# EAGLE design CAA-NMC-2 (EAGLE 9.2.2)
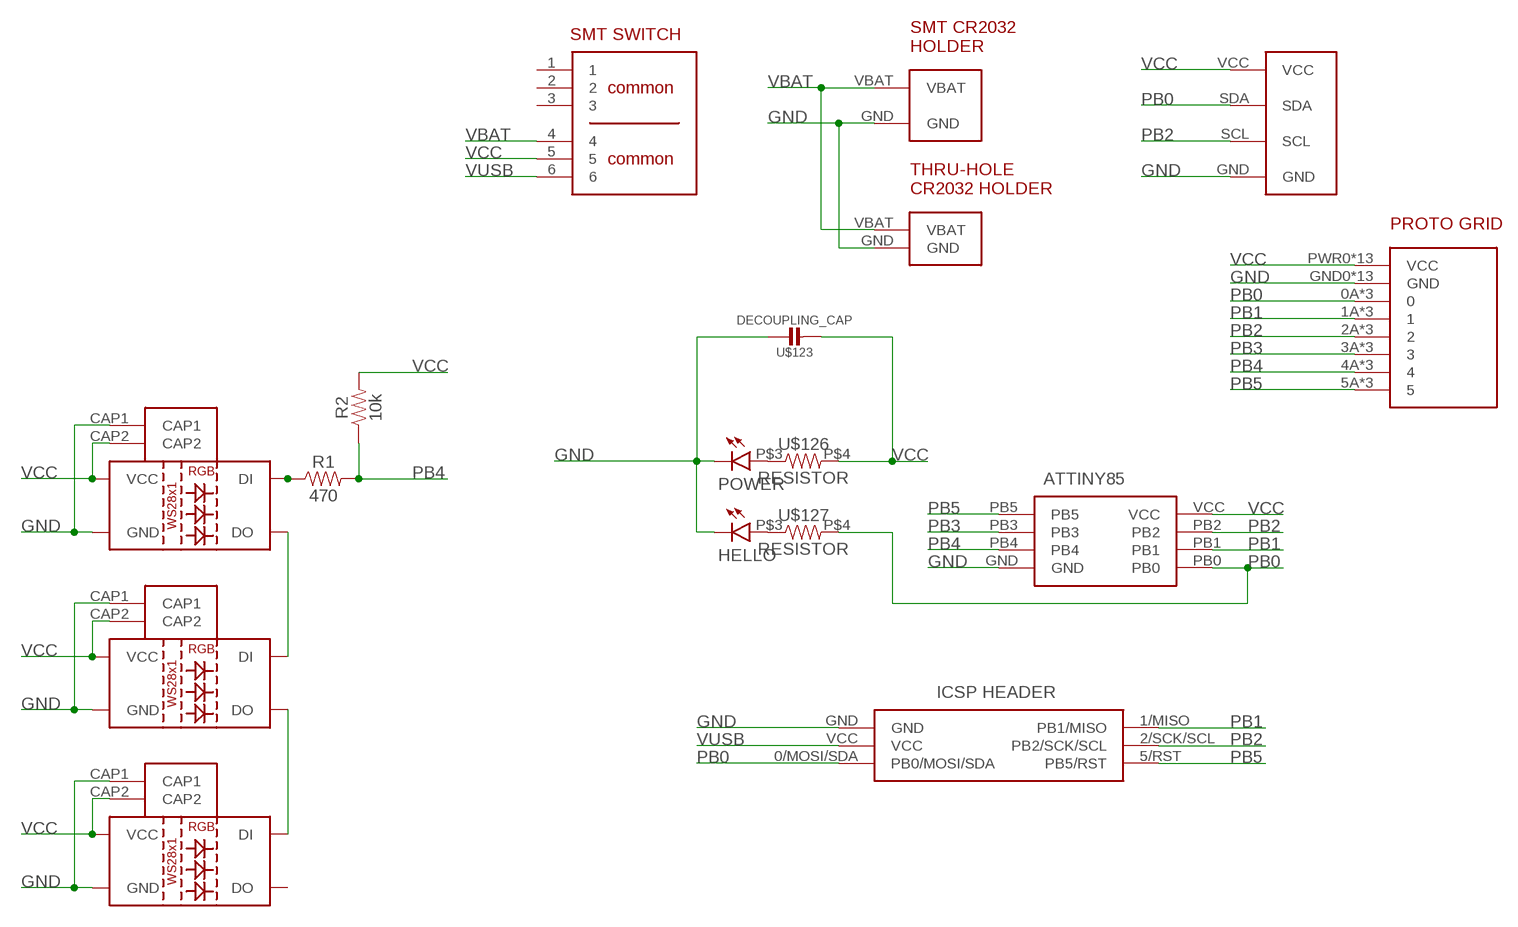
[diagram p0: schematic, sheet 1]

## Parts
D1  WS2812B  [WS2812B]
D2  WS2812B  [WS2812B]
D3  WS2812B  [WS2812B]
HELLO  LED3MM  [LED3MM]
IC1  ATTINY85-20SU  [SOT127P798X216-8N]
J1  M20-9980346  [HDRV6W64P254_2X3_762X508X868P]
POWER  LED3MM  [LED3MM]
R1  470  470OHM-0603-1/10W-1%  [0603]
R2  10k  10KOHM-0603-1/10W-1%  [0603]
U$1  PROTO  [PROTO]
U$2  SMT-BATTERY-HOLDER  [SMT-CR-HOLDER]
U$3  THRU-CR-HOLDER  [THRU-CR-HOLDER]
U$4  I2C-PADS  [I2C-PADS]
U$123  DECOUPLING_CAP  [DECOUPLING_CAP]
U$126  RESISTOR  [AXIAL-0.3]
U$127  RESISTOR  [AXIAL-0.3]
U$145  SMT-SWITCH  [SMT-SWITCH]

## Nets
GND [GND]: D1.CAP1 D1.GND D2.CAP1 D2.GND D3.CAP1 D3.GND HELLO.NEG IC1.GND J1.GND POWER.NEG U$1.GND0(GND) U$1.GND1(GND) U$1.GND2(GND) U$1.GND3(GND) U$1.GND4(GND) U$1.GND5(GND) U$1.GND6(GND) U$1.GND7(GND) U$1.GND8(GND) U$1.GND9(GND) U$1.GND10(GND) U$1.GND11(GND) U$1.GND12(GND) U$2.GND U$3.GND U$4.GND U$123.P$1
N$1: POWER.POS U$126.P$3
N$2: HELLO.POS U$127.P$3
N$3: D1.DO D2.DI
N$4: D2.DO D3.DI
N$5: D1.DI R1.1
PB0: IC1.PB0 J1.0/MOSI/SDA(PB0/MOSI/SDA) U$1.0A U$1.0B U$1.0C U$4.SDA U$127.P$4
PB1: IC1.PB1 J1.1/MISO(PB1/MISO) U$1.1A U$1.1B U$1.1C
PB2: IC1.PB2 J1.2/SCK/SCL(PB2/SCK/SCL) U$1.2A U$1.2B U$1.2C U$4.SCL
PB3: IC1.PB3 U$1.3A U$1.3B U$1.3C
PB4: IC1.PB4 R1.2 R2.1 U$1.4A U$1.4B U$1.4C
PB5: IC1.PB5 J1.5/RST(PB5/RST) U$1.5A U$1.5B U$1.5C
VBAT [VBAT]: U$2.VBAT U$3.VBAT U$145.4
VCC [VCC]: D1.CAP2 D1.VCC D2.CAP2 D2.VCC D3.CAP2 D3.VCC IC1.VCC R2.2 U$1.PWR0(VCC) U$1.PWR1(VCC) U$1.PWR2(VCC) U$1.PWR3(VCC) U$1.PWR4(VCC) U$1.PWR5(VCC) U$1.PWR6(VCC) U$1.PWR7(VCC) U$1.PWR8(VCC) U$1.PWR9(VCC) U$1.PWR10(VCC) U$1.PWR11(VCC) U$1.PWR12(VCC) U$4.VCC U$123.P$2 U$126.P$4 U$145.5
VUSB: J1.VCC U$145.6
Unconnected: D3.DO U$145.1 U$145.2 U$145.3

## Library data of the parts
D1-D3 = BadgeParts:WS2812B: WS2812B SMD addressable RGB LED 5x5mm SMD LED with built-in controller IC. Color: Red/Green/Blue mC Rating: RGB: 390, 660, 180 mcd Forward Voltage: RGB: 2.0, 3.0, 3.0 V Packages:WS2812B SparkFun Products: Blynk Board - ESP8266 <https://www.sparkfun.com/products/13794>; PROD_ID: DIO-12503
HELLO POWER = BadgeParts:LED3MM
IC1 = BadgeParts:ATTINY85-20SU: MICROCHIP - ATTINY85-20SU - MICROCONTROLLER MCU, 8 BIT, ATTINY, 20MHZ, SOIC-8 Source: Datasheet <https://componentsearchengine.com/Datasheets/2/ATTINY85-20SU.pdf>; ARROW_PART_NUMBER: ATTINY85-20SU; ARROW_PRICE/STOCK: https://www.arrow.com/en/products/attiny85-20su/microchip-technology; DESCRIPTION: MICROCHIP - ATTINY85-20SU - MICROCONTROLLER MCU, 8 BIT, ATTINY, 20MHZ, SOIC-8; HEIGHT: 2.16mm; MANUFACTURER_NAME: Microchip; MANUFACTURER_PART_NUMBER: ATTINY85-20SU; RS_PART_NUMBER: 1331674; RS_PRICE/STOCK: http://uk.rs-online.com/web/p/products/1331674
J1 = BadgeParts:M20-9980346: 03+03 DIL Vertical Pin Header HARWIN M20 Series, 2.54mm Pitch 6 Way 2 Row Straight PCB Header, Solder Termination, 3A Source: Datasheet <https://cdn.harwin.com/pdfs/M20-998.pdf?utm_source=3D_PDF&utm_medium=3D_PDF&utm_campaign=3D_PDF>; ARROW_PART_NUMBER: M20-9980346; ARROW_PRICE/STOCK: http://uk.rs-online.com/web/p/products/7457046P; DESCRIPTION: 03+03 DIL Vertical Pin Header HARWIN M20 Series, 2.54mm Pitch 6 Way 2 Row Straight PCB Header, Solder Termination, 3A; HEIGHT: 8.68mm; MANUFACTURER_NAME: HARWIN; MANUFACTURER_PART_NUMBER: M20-9980346; RS_PART_NUMBER: 7457046P; RS_PRICE/STOCK: http://uk.rs-online.com/web/p/products/7457046P
R1 = SparkFun-Resistors:470OHM: 470Ω resistor A resistor is a passive two-terminal electrical component that implements electrical resistance as a circuit element. Resistors act to reduce current flow, and, at the same time, act to lower voltage levels within circuits. - Wikipedia; PROD_ID: RES-07869
R2 = SparkFun-Resistors:10KOHM: 10kΩ resistor A resistor is a passive two-terminal electrical component that implements electrical resistance as a circuit element. Resistors act to reduce current flow, and, at the same time, act to lower voltage levels within circuits. - Wikipedia; PROD_ID: RES-00824
U$1 = BadgeParts:PROTO
U$2 = BadgeParts:SMT-BATTERY-HOLDER
U$3 = BadgeParts:THRU-CR-HOLDER
U$4 = BadgeParts:I2C-PADS
U$123 = BadgeParts:DECOUPLING_CAP
U$126 U$127 = BadgeParts:RESISTOR
U$145 = BadgeParts:SMT-SWITCH

## Net classes
0 default: width 0.254 mm, clearance 0.254 mm
1 VCC: width 0.381 mm, clearance 0.254 mm
2 GND: width 0.381 mm, clearance 0.254 mm
3 VBAT: width 0.381 mm, clearance 0.254 mm

## Board
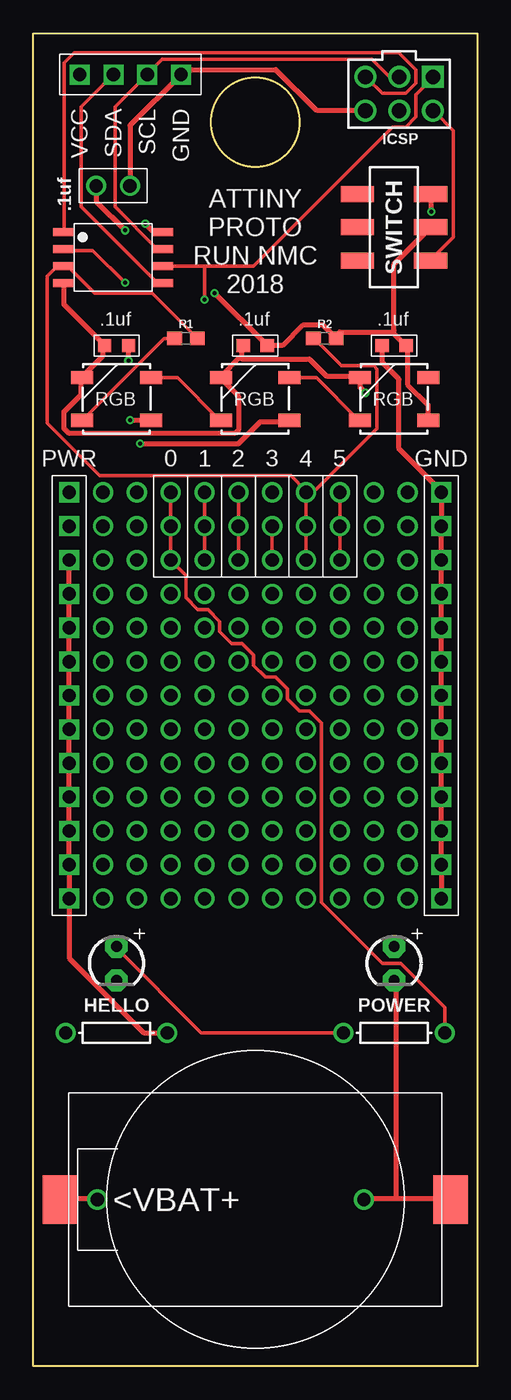
[diagram p1: board, top side]
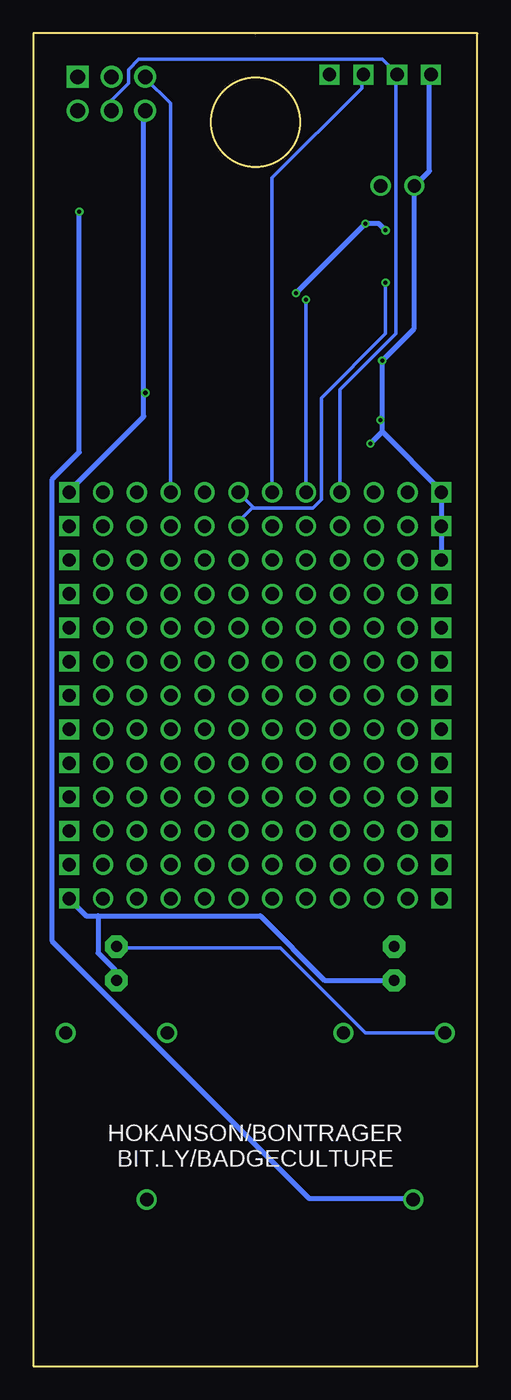
[diagram p2: board, bottom side, seen from below]

Size 33.33 x 100 mm. Coordinates in mm from the lower left corner, seen from the top.
Outline: 0,100 0,0 33.33,0 33.33,100 0,100
Outline: 0,100 16.67,100
Outline: circle at 16.66,93.32 radius 3.33
Copper layers (1*16): Top 0.035mm / dielectric 1.5mm / Bottom 0.035mm
Design rules "SeeedStudio_2layer_DRU_no_angle_20140221": minimum track width 6mil, minimum drill 12mil, track to track 6mil, track to pad 6mil, pad to pad 6mil, via to via 6mil, smd to smd 0mil, copper to edge 10mil, drill to drill 10mil, minimum pad ring 10mil, minimum via ring 6mil, stop-mask expansion 2mil, vias tented up to drill 100mil, thermal gap 10mil

### Footprints (pad centres in the part's own frame; a part is rotated, then mirrored left to right if it is on the bottom)
WS2812B = smd 1 x 1: CAP1 -0.9,4; CAP2 0.9,4 | smd 1.651 x 1: DI -2.577,-1.6; DO 2.577,1.6; GND -2.577,1.6; VCC 2.577,-1.6
LED3MM = drill 0.813 pad 1.676 octagon: NEG 1.27,0; POS -1.27,0
SOT127P798X216-8N = smd 1.5 x 0.6: GND -3.75,-1.905; PB0 3.75,-1.905; PB1 3.75,-0.635; PB2 3.75,0.635; PB3 -3.75,0.635; PB4 -3.75,-0.635; PB5 -3.75,1.905; VCC 3.75,1.905
HDRV6W64P254_2X3_762X508X868P = drill 1.1 pad 1.65: 0/MOSI/SDA 0,1.27; 2/SCK/SCL 0,3.81; 5/RST -2.54,3.81; GND -2.54,1.27; VCC 2.54,1.27 | drill 1.1 pad 1.65 square: 1/MISO 2.54,3.81
0603 = smd 1.1 x 1: 1 -0.85,0; 2 0.85,0
PROTO = drill 1: 0A -6.35,30.48; 0B -6.35,27.94; 0C -6.35,25.4; 1A -3.81,30.48; 1B -3.81,27.94; 1C -3.81,25.4; 2A -1.27,30.48; 2B -1.27,27.94; 2C -1.27,25.4; 3A 1.27,30.48; 3B 1.27,27.94; 3C 1.27,25.4; 4A 3.81,30.48; 4B 3.81,27.94; 4C 3.81,25.4; 5A 6.35,30.48; 5B 6.35,27.94; 5C 6.35,25.4; VSTRIP1 -8.89,22.86; VSTRIP2 -8.89,20.32; VSTRIP3 -8.89,17.78; VSTRIP4 -8.89,15.24; VSTRIP5 -8.89,12.7; VSTRIP6 -6.35,22.86; VSTRIP7 -6.35,20.32; VSTRIP8 -6.35,17.78; VSTRIP9 -6.35,15.24; VSTRIP10 -6.35,12.7; VSTRIP11 -11.43,10.16; VSTRIP12 -11.43,7.62; VSTRIP13 -11.43,5.08; VSTRIP14 -11.43,2.54; VSTRIP15 -11.43,0; VSTRIP16 -3.81,22.86; VSTRIP17 -3.81,20.32; VSTRIP18 -3.81,17.78; VSTRIP19 -3.81,15.24; VSTRIP20 -3.81,12.7; VSTRIP21 -1.27,22.86; VSTRIP22 -1.27,20.32; VSTRIP23 -1.27,17.78; VSTRIP24 -1.27,15.24; VSTRIP25 -1.27,12.7; VSTRIP26 1.27,22.86; VSTRIP27 1.27,20.32; VSTRIP28 1.27,17.78; VSTRIP29 1.27,15.24; VSTRIP30 1.27,12.7; VSTRIP31 3.81,22.86; VSTRIP32 3.81,20.32; VSTRIP33 3.81,17.78; VSTRIP34 3.81,15.24; VSTRIP35 3.81,12.7; VSTRIP36 6.35,22.86; VSTRIP37 6.35,20.32; VSTRIP38 6.35,17.78; VSTRIP39 6.35,15.24; VSTRIP40 6.35,12.7; VSTRIP41 8.89,22.86; VSTRIP42 8.89,20.32; VSTRIP43 8.89,17.78; VSTRIP44 8.89,15.24; VSTRIP45 8.89,12.7; VSTRIP46 11.43,22.86; VSTRIP47 11.43,20.32; VSTRIP48 11.43,17.78; VSTRIP49 11.43,15.24; VSTRIP50 11.43,12.7; VSTRIP51 -11.43,22.86; VSTRIP52 -11.43,20.32; VSTRIP53 -11.43,17.78; VSTRIP54 -11.43,15.24; VSTRIP55 -8.89,10.16; VSTRIP56 -8.89,7.62; VSTRIP57 -8.89,5.08; VSTRIP58 -8.89,2.54; VSTRIP59 -8.89,0; VSTRIP60 -11.43,12.7; VSTRIP61 -8.89,30.48; VSTRIP62 -8.89,27.94; VSTRIP63 -8.89,25.4; VSTRIP64 -11.43,30.48; VSTRIP65 -11.43,27.94; VSTRIP66 -11.43,25.4; VSTRIP67 8.89,30.48; VSTRIP68 8.89,27.94; VSTRIP69 8.89,25.4; VSTRIP70 11.43,30.48; VSTRIP71 11.43,27.94; VSTRIP72 11.43,25.4; VSTRIP75 -6.35,10.16; VSTRIP76 -6.35,7.62; VSTRIP77 -6.35,5.08; VSTRIP78 -6.35,2.54; VSTRIP79 -6.35,0; VSTRIP95 -3.81,10.16; VSTRIP96 -3.81,7.62; VSTRIP97 -3.81,5.08; VSTRIP98 -3.81,2.54; VSTRIP99 -3.81,0; VSTRIP115 -1.27,10.16; VSTRIP116 -1.27,7.62; VSTRIP117 -1.27,5.08; VSTRIP118 -1.27,2.54; VSTRIP119 -1.27,0; VSTRIP135 1.27,10.16; VSTRIP136 1.27,7.62; VSTRIP137 1.27,5.08; VSTRIP138 1.27,2.54; VSTRIP139 1.27,0; VSTRIP155 3.81,10.16; VSTRIP156 3.81,7.62; VSTRIP157 3.81,5.08; VSTRIP158 3.81,2.54; VSTRIP159 3.81,0; VSTRIP175 6.35,10.16; VSTRIP176 6.35,7.62; VSTRIP177 6.35,5.08; VSTRIP178 6.35,2.54; VSTRIP179 6.35,0; VSTRIP195 8.89,10.16; VSTRIP196 8.89,7.62; VSTRIP197 8.89,5.08; VSTRIP198 8.89,2.54; VSTRIP199 8.89,0; VSTRIP215 11.43,10.16; VSTRIP216 11.43,7.62; VSTRIP217 11.43,5.08; VSTRIP218 11.43,2.54; VSTRIP219 11.43,0 | drill 1 square: GND0 13.97,0; GND1 13.97,2.54; GND2 13.97,5.08; GND3 13.97,7.62; GND4 13.97,10.16; GND5 13.97,12.7; GND6 13.97,15.24; GND7 13.97,17.78; GND8 13.97,20.32; GND9 13.97,22.86; GND10 13.97,25.4; GND11 13.97,27.94; GND12 13.97,30.48; PWR0 -13.97,0; PWR1 -13.97,2.54; PWR2 -13.97,5.08; PWR3 -13.97,7.62; PWR4 -13.97,10.16; PWR5 -13.97,12.7; PWR6 -13.97,15.24; PWR7 -13.97,17.78; PWR8 -13.97,20.32; PWR9 -13.97,22.86; PWR10 -13.97,25.4; PWR11 -13.97,27.94; PWR12 -13.97,30.48
SMT-CR-HOLDER = smd 2.6 x 3.65: GND 14.65,0; VBAT -14.65,0
THRU-CR-HOLDER = drill 1: GND 8.15,0; VBAT -11.85,0
I2C-PADS = drill 1 square: GND 0,3.81; SCL 0,1.27; SDA 0,-1.27; VCC 0,-3.81
DECOUPLING_CAP = drill 1: P$1 0,0; P$2 2.54,0
AXIAL-0.3 = drill 1: P$3 -3.81,0; P$4 3.81,0
SMT-SWITCH = smd 1.2 x 2.5: 1 -2.5,-2.75; 2 0,-2.75; 3 2.5,-2.75; 4 -2.5,2.75; 5 0,2.75; 6 2.5,2.75

### Placement (x,y rotation side)
D1  6.25,72.57 0 top
D2  16.66,72.57 0 top
D3  27.09,72.57 0 top
HELLO  6.25,30.22 270 top
IC1  5.99,83.18 0 top
J1  27.47,92.93 0 top
POWER  27.09,30.22 270 top
R1  11.46,77.11 0 top
R2  21.88,77.11 0 top
U$1  16.67,35.08 0 top
U$2  16.67,12.5 0 top
U$3  16.67,12.5 0 top
U$4  7.29,96.91 270 top
U$123  7.26,88.56 180 top
U$126  6.25,25.01 0 top
U$127  27.09,25.01 0 top
U$145  27.09,85.44 270 top

### Tracks (layer width: path | path; a pad name or v marks a point on that pad's centre or on a via)
GND  (via drill 0.3)
  Top 0.381: IC1.GND 2.31,81.15 2.31,79.63 5.24,76.71 D1.CAP1 5.24,76.45 5.24,75.82 3.71,74.3 D1.GND 3.59,74.04 3.59,72.9 2.31,71.63 2.31,70.36 2.7,69.98 15.14,69.98 15.4,70.23 15.4,72.77 14.13,74.04 D2.GND 14.13,74.3 15.52,75.69 | 15.52,75.69 15.65,75.82 15.65,76.45 D2.CAP1 | 15.52,75.69 15.65,75.56 20.73,75.56 22,74.3 24.41,74.3 D3.GND 24.54,74.04 24.54,73.41 v24.92,73.03 | U$123.P$1 7.27,88.65 7.27,93.09 11.08,96.9 U$4.GND 11.21,97.03 11.46,97.28 18.19,97.28 21.24,94.23 24.92,94.23 J1.GND | D3.CAP1 26.19,76.45 26.19,75.31 27.46,74.04 27.46,68.83 30.64,65.66 U$1.GND12 U$1.GND11 U$1.GND10 U$1.GND9 U$1.GND8 U$1.GND7 U$1.GND6 U$1.GND5 U$1.GND4 U$1.GND3 U$1.GND2 U$1.GND1 U$1.GND0 | 27.21,12.57 31.27,12.57 U$2.GND | 27.21,12.57 24.92,12.57 U$3.GND | 27.21,12.57 27.21,28.83 POWER.NEG
  Bottom 0.381: 28.48,33.78 29.37,33.78 30.64,35.05 U$1.GND0 | 28.48,33.78 16.29,33.78 11.46,28.96 HELLO.NEG | 28.48,33.78 28.48,30.99 27.21,29.72 27.21,28.96 POWER.NEG | 25.05,73.03 25.05,71.25 30.64,65.66 U$1.GND12 | 25.05,73.03 25.05,94.11 J1.GND | v24.92,73.03 25.05,73.03
N$1
  Bottom 0.254: U$126.P$3 8.41,25.02 14.76,31.37 27.08,31.37 POWER.POS
N$2
  Top 0.254: U$127.P$3 12.6,25.02 6.25,31.37 HELLO.POS
N$3
  Top 0.254: D1.DO 8.92,74.17 10.82,74.17 14,70.99 D2.DI
N$4
  Top 0.254: D2.DO 19.33,74.17 21.24,74.17 24.41,70.99 D3.DI
N$5
  Top 0.254: R1.1 10.57,77.09 9.81,77.09 3.71,70.99 D1.DI
PB0
  Top 0.254: IC1.PB0 9.68,81.28 9.3,81.28 3.59,87 3.59,94.49 6,96.9 U$4.SDA | U$127.P$4 30.89,26.92 27.59,30.23 26.19,30.23 21.62,34.8 21.62,48.26 20.73,49.15 19.97,49.15 19.08,50.04 19.08,50.8 18.19,51.69 17.43,51.69 16.54,52.58 16.54,53.34 15.65,54.23 14.89,54.23 14,55.12 14,55.88 13.11,56.77 12.35,56.77 11.46,57.66 11.46,59.31 10.32,60.45 U$1.0C U$1.0B U$1.0A
  Bottom 0.254: J1.0/MOSI/SDA 27.46,94.23 27.46,95 26.19,96.27 26.19,97.28 25.43,98.04 7.14,98.04 6.12,97.03 U$4.SDA 6.12,96.9 6.12,77.47 10.32,73.28 U$1.0A
PB1  (via drill 0.3)
  Top 0.254: U$1.1C U$1.1B U$1.1A | 12.86,82.55 16.54,82.55 26.95,92.96 27.97,92.96 28.73,93.73 28.73,95.38 30,96.65 J1.1/MISO | 12.86,82.55 9.81,82.55 IC1.PB1 | 12.86,82.55 v12.86,80.01
  Bottom 0.254: v12.86,80.01 U$1.1A
PB2
  Top 0.254: U$1.2C U$1.2B U$1.2A | IC1.PB2 9.68,83.82 9.3,83.82 6.12,87 6.12,94.49 8.54,96.9 U$4.SCL 8.67,97.03 9.68,98.04 25.43,98.04 26.7,96.77 27.46,96.77 J1.2/SCK/SCL
  Bottom 0.254: U$1.2A 15.4,89.15 8.67,95.89 8.67,96.9 U$4.SCL
PB3  (via drill 0.3)
  Top 0.254: U$1.3B U$1.3C | v6.89,81.28 4.47,83.69 2.31,83.69 IC1.PB3
  Bottom 0.254: v6.89,81.28 6.89,77.47 11.71,72.64 11.71,65.02 12.35,64.39 16.79,64.39 16.86,64.45 | 16.86,64.45 17.94,65.53 U$1.3A | U$1.3B 17.94,63.37 16.86,64.45
PB4
  Top 0.254: R1.2 12.22,77.22 8.92,80.52 4.6,80.52 2.7,82.42 2.31,82.42 IC1.PB4 2.19,82.42 1.68,82.42 1.04,81.79 1.04,70.74 4.98,66.8 19.33,66.8 20.48,65.66 | U$1.4C U$1.4B U$1.4A 20.48,65.66 | 20.48,65.66 21.11,65.66 25.81,70.36 25.81,74.8 25.56,75.06 23.14,75.06 21.11,77.09 R2.1
PB5
  Top 0.254: U$1.5C U$1.5B U$1.5A | IC1.PB5 2.31,85.09 2.31,97.79 3.08,98.55 27.46,98.55 28.73,97.28 28.73,96.27 27.97,95.5 26.19,95.5 25.05,96.65 J1.5/RST
  Bottom 0.254: U$1.5A 23.02,94.74 24.92,96.65 J1.5/RST
VBAT  (via drill 0.3)
  Top 0.381: v29.87,86.61 29.87,87.88 U$145.4 | U$2.VBAT 2.06,12.57 4.73,12.57 U$3.VBAT
  Bottom 0.381: v29.87,86.61 29.87,68.58 31.91,66.55 31.91,31.88 12.6,12.57 4.86,12.57 U$3.VBAT
VCC  (via drill 0.3)
  Top 0.381: U$1.PWR10 U$1.PWR9 U$1.PWR8 U$1.PWR7 U$1.PWR6 U$1.PWR5 U$1.PWR4 U$1.PWR3 U$1.PWR2 U$1.PWR1 U$1.PWR0 2.7,30.61 8.28,25.02 9.94,25.02 U$126.P$4 | 26.95,77.6 27.97,76.58 D3.CAP2 28.1,76.45 28.1,73.66 29.62,72.14 29.62,70.99 D3.VCC | 26.95,77.6 23.02,77.6 22.76,77.34 R2.2 22.64,77.22 21.75,78.11 20.22,78.11 18.7,76.58 17.68,76.58 D2.CAP2 17.43,76.71 v13.62,80.52 | U$145.5 29.75,85.34 27.08,82.68 27.08,77.72 26.95,77.6 | v8.41,85.72 9.05,85.09 9.68,85.09 IC1.VCC | v6.89,85.22 4.73,87.38 4.73,88.52 U$123.P$2 | v7.14,75.44 7.14,76.45 D1.CAP2 | v7.27,70.99 8.79,70.99 D1.VCC | v8.03,69.22 15.4,69.22 17.05,70.87 19.21,70.87 D2.VCC
  Bottom 0.381: v6.89,85.22 7.39,85.72 v8.41,85.72 v13.62,80.52 | U$4.VCC 3.59,96.9 3.59,89.66 4.6,88.65 U$123.P$2 4.73,88.39 4.73,77.85 v7.14,75.44 7.14,70.99 | 7.14,70.1 7.14,70.99 | 7.14,70.1 2.7,65.66 U$1.PWR12 U$1.PWR11 U$1.PWR10 | v7.27,70.99 7.14,70.99 | 7.14,70.1 v8.03,69.22
VUSB
  Top 0.254: U$145.6 29.87,83.06 31.52,84.71 31.52,92.71 30.13,94.11 J1.VCC

### Text on the board
tPlace: .1uf | ATTINY / PROTO / RUN NMC / 2018 | HELLO | POWER
bPlace: HOKANSON/BONTRAGER / BIT.LY/BADGECULTURE